# Altium project MantraDisplay.PrjPcb
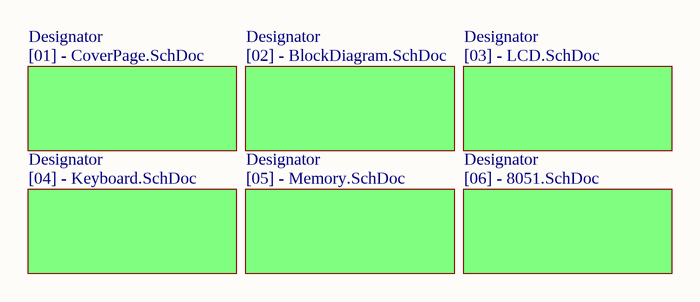
[diagram p0: DisplayBoard.SchDoc]
7 sheets, 33 parts. Net scope: flat (ports and power ports of the same name join across sheets).
Board file: DisplayBoard.PcbDoc
Sheets:
  DisplayBoard.SchDoc
    Designator = [01] - CoverPage.SchDoc
    Designator = [04] - Keyboard.SchDoc
    Designator = [02] - BlockDiagram.SchDoc
    Designator = [05] - Memory.SchDoc
    Designator = [03] - LCD.SchDoc
    Designator = [06] - 8051.SchDoc

## Sheet DisplayBoard.SchDoc: Mantra Display Board
size A4; Author: MikrySoft; Address1: MikrySoft@gmail.com; DocumentNumber: 1; Revision: 1; SheetNumber: 1; SheetTotal: 7

### Sub-sheets
Designator = [01] - CoverPage.SchDoc: no entries
Designator = [04] - Keyboard.SchDoc: no entries
Designator = [02] - BlockDiagram.SchDoc: no entries
Designator = [05] - Memory.SchDoc: no entries
Designator = [03] - LCD.SchDoc: no entries
Designator = [06] - 8051.SchDoc: no entries

### Notes on the sheet
- Title
- Size:
- Date:
- A4
- Number:
- Time:
- Revision:
- Sheet
- of
- Variation:
- Author:
- E-Mail:
- File:

## Sheet [01] - CoverPage.SchDoc: Mantra Display Board
size A4; Author: MikrySoft; Address1: MikrySoft@gmail.com; DocumentNumber: 2; Revision: 1; SheetNumber: 2; SheetTotal: 7

### Notes on the sheet
- Title
- Size:
- Date:
- A4
- Number:
- Time:
- Revision:
- Sheet
- of
- Variation:
- Author:
- E-Mail:
- File:

## Sheet [04] - Keyboard.SchDoc: Mantra Display Board
size A4; Author: MikrySoft; Address1: MikrySoft@gmail.com; DocumentNumber: 5; Revision: 1; SheetNumber: 5; SheetTotal: 7
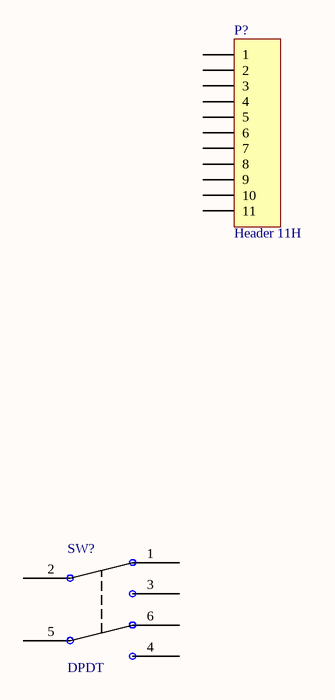
[diagram p1: [04] - Keyboard.SchDoc]

### Parts
(Parts that share a designator on the sheet are numbered #1, #2 ... from top to bottom, then left to right.)
P?#1  Header 11H  [HDR1X11H]
SW?  DPDT  [SW-EG2215]

### Nets

Not connected (* = marked no-connect by the designer): P?#1 1 2 3 4 5 6 7 8 9 10 11; SW? 1(NC-1) 2(CC-1) 3(NO-1) 4(NO-2) 5(CC-2) 6(NC-2)

### Notes on the sheet
- Title
- Size:
- Date:
- A4
- Number:
- Time:
- Revision:
- Sheet
- of
- Variation:
- Author:
- E-Mail:
- File:

### Library data of the parts
P?#1 = Header 11H: Header, 11-Pin, Right Angle; LatestRevisionDate: 17-Jul-2002; LatestRevisionNote: Re-released for DXP Platform.; Publisher: Altium Limited
SW? = SW-DPDT

## Sheet [02] - BlockDiagram.SchDoc: Mantra Display Board
size A4; Author: MikrySoft; Address1: MikrySoft@gmail.com; DocumentNumber: 3; Revision: 1; SheetNumber: 3; SheetTotal: 7

### Notes on the sheet
- Title
- Size:
- Date:
- A4
- Number:
- Time:
- Revision:
- Sheet
- of
- Variation:
- Author:
- E-Mail:
- File:

## Sheet [05] - Memory.SchDoc: Mantra Display Board
size A4; Author: MikrySoft; Address1: MikrySoft@gmail.com; DocumentNumber: 6; Revision: 1; SheetNumber: 6; SheetTotal: 7
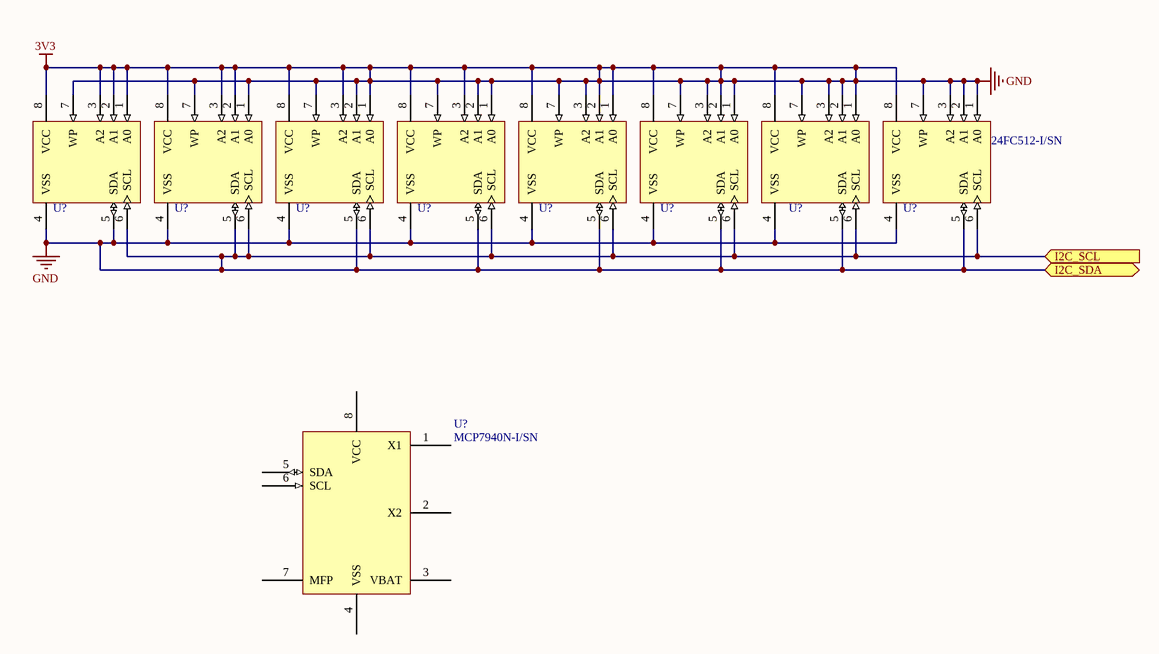
[diagram p2: [05] - Memory.SchDoc]

### Parts
(Parts that share a designator on the sheet are numbered #1, #2 ... from top to bottom, then left to right.)
U?#1  24FC512-I/SN  [MCHP-SOIC-SN8_N]  (value not drawn)
U?#2  24FC512-I/SN  [MCHP-SOIC-SN8_N]  (value not drawn)
U?#3  24FC512-I/SN  [MCHP-SOIC-SN8_N]  (value not drawn)
U?#4  24FC512-I/SN  [MCHP-SOIC-SN8_N]  (value not drawn)
U?#5  24FC512-I/SN  [MCHP-SOIC-SN8_N]  (value not drawn)
U?#6  24FC512-I/SN  [MCHP-SOIC-SN8_N]  (value not drawn)
U?#7  24FC512-I/SN  [MCHP-SOIC-SN8_N]  (value not drawn)
U?#8  24FC512-I/SN  [MCHP-SOIC-SN8_N]
U?#9  MCP7940N-I/SN  [MCP7940N-SOIC127P600X175-8N]

### Ports
I2C_SCL (in), I2C_SDA (bidir)

### Nets
3V3: U?#1.1(A0) U?#1.2(A1) U?#1.3(A2) U?#1.4(VSS) U?#1.5(SDA) U?#1.6(SCL) U?#1.7(WP) U?#1.8(VCC) U?#2.1(A0) U?#2.2(A1) U?#2.3(A2) U?#2.4(VSS) U?#2.5(SDA) U?#2.6(SCL) U?#2.7(WP) U?#2.8(VCC) U?#3.1(A0) U?#3.2(A1) U?#3.3(A2) U?#3.4(VSS) U?#3.5(SDA) U?#3.6(SCL) U?#3.7(WP) U?#3.8(VCC) U?#4.1(A0) U?#4.2(A1) U?#4.3(A2) U?#4.4(VSS) U?#4.5(SDA) U?#4.6(SCL) U?#4.7(WP) U?#4.8(VCC) U?#5.1(A0) U?#5.2(A1) U?#5.3(A2) U?#5.4(VSS) U?#5.5(SDA) U?#5.6(SCL) U?#5.7(WP) U?#5.8(VCC) U?#6.1(A0) U?#6.2(A1) U?#6.3(A2) U?#6.4(VSS) U?#6.5(SDA) U?#6.6(SCL) U?#6.7(WP) U?#6.8(VCC) U?#7.1(A0) U?#7.2(A1) U?#7.3(A2) U?#7.4(VSS) U?#7.5(SDA) U?#7.6(SCL) U?#7.7(WP) U?#7.8(VCC) U?#8.1(A0) U?#8.2(A1) U?#8.3(A2) U?#8.4(VSS) U?#8.5(SDA) U?#8.6(SCL) U?#8.7(WP) U?#8.8(VCC) ; port I2C_SCL, port I2C_SDA  [also labelled GND]  [project net SCL]

Not connected (* = marked no-connect by the designer): U?#9 1(X1) 2(X2) 3(VBAT) 4(VSS) 5(SDA) 6(SCL) 7(MFP) 8(VCC)

### Notes on the sheet
- Title
- Size:
- Date:
- A4
- Number:
- Time:
- Revision:
- Sheet
- of
- Variation:
- Author:
- E-Mail:
- File:

### Library data of the parts
U?#1-U?#8 = 24FC512-I/SN: 512K bits I2C™ Serial EEPROM, 1.7 to 5.5 V, 1 MHz, -40 to 85 degC, 8-pin SOIC (SN8), Tube; Manufacturer: Microchip; DatasheetVersion: Rev. M; PackageVersion: C04-057C; PackageReference: SOIC-SN8; PackageDescription: 8-Lead Plastic Small Outline, 4.9 x 3.9 mm Body, 1.27 mm Pitch; Supplier 1: Digi-Key; Supplier Part Number 1: 24FC512-I/SN-ND; Supplier 2: Newark; Supplier Part Number 2: 08R2176; Supplier 3: Mouser; Supplier Part Number 3: 579-24FC512-I/SN; Mounting Technology: Surface Mount; PartNumber: 24FC512-I/SN; ComponentLink1Description: Manufacturer URL; ComponentLink1URL: http://www.microchip.com; ComponentLink2Description: Datasheet; ComponentLink2URL: http://ww1.microchip.com/downloads/en/DeviceDoc/21754M.pdf; ComponentLink3Description: Package Specification; ComponentLink3URL: http://www.microchip.com/stellent/groups/techpub_sg/documents/packagingspec/en012702.pdf; ComponentLink4Description: Product URL; ComponentLink4URL: http://www.microchip.com/24FC512
U?#9 = MCP7940N-I/SN: I2C RTCC with SRAM

## Sheet [03] - LCD.SchDoc: Mantra Display Board
size A4; Author: MikrySoft; Address1: MikrySoft@gmail.com; DocumentNumber: 4; Revision: 1; SheetNumber: 4; SheetTotal: 7
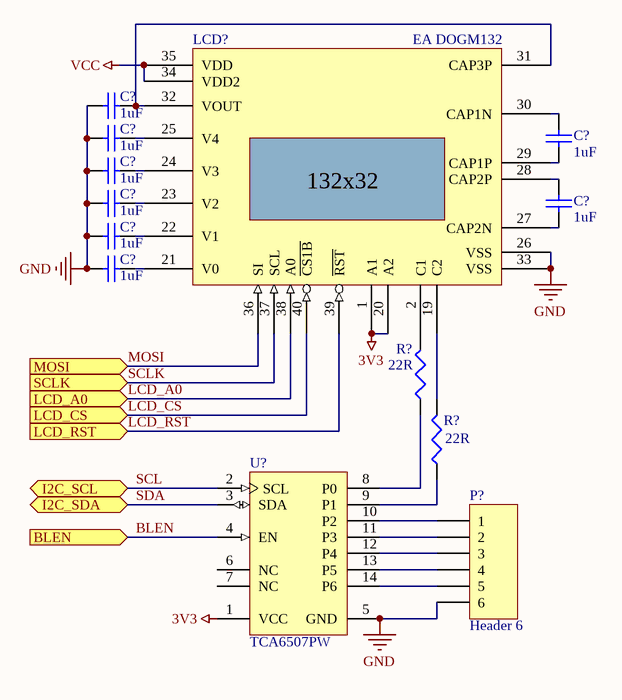
[diagram p3: [03] - LCD.SchDoc]

### Parts
(Parts that share a designator on the sheet are numbered #1, #2 ... from top to bottom, then left to right.)
C?#1  value 1uF  [1608[0603]]  (hidden comment: Cap Semi)
C?#2  value 1uF  [1608[0603]]  (hidden comment: Cap Semi)
C?#3  value 1uF  [1608[0603]]  (hidden comment: Cap Semi)
C?#4  value 1uF  [1608[0603]]  (hidden comment: Cap Semi)
C?#5  value 1uF  [1608[0603]]  (hidden comment: Cap Semi)
C?#6  value 1uF  [1608[0603]]  (hidden comment: Cap Semi)
C?#7  value 1uF  [1608[0603]]  (hidden comment: Cap Semi)
C?#8  value 1uF  [1608[0603]]  (hidden comment: Cap Semi)
LCD?  EA DOGM132  [EA DOGM132-5]
P?#2  Header 6  [HDR1X6]
R?#1  value 22R  [J1-0603]  (hidden comment: Res3)
R?#2  value 22R  [J1-0603]  (hidden comment: Res3)
U?#10  TCA6507PW  [PW14_M]

### Ports
BLEN (in), I2C_SCL (bidir), I2C_SDA (bidir), LCD_A0 (in), LCD_CS (in), LCD_RST (in), MOSI (in), SCLK (in)

### Nets
SCL: C?#1.1 C?#2.1 C?#4.1 C?#5.1 C?#7.1 C?#8.1 LCD?.1(A1) LCD?.20(A2) LCD?.26(VSS) LCD?.33(VSS) P?#2.6 U?#10.1(VCC) U?#10.2(SCL) U?#10.3(SDA) U?#10.5(GND) ; port I2C_SDA, port I2C_SCL  [also labelled 3V3, GND, SDA]
VCC: LCD?.34(VDD2) LCD?.35(VDD)
BLEN: U?#10.4(EN) ; port BLEN
LCD_A0: LCD?.38(A0) ; port LCD_A0
LCD_CS: LCD?.40(~{CS1B}) ; port LCD_CS
LCD_RST: LCD?.39(~{RST}) ; port LCD_RST
MOSI: LCD?.36(SI) ; port MOSI
SCLK: LCD?.37(SCL) ; port SCLK
NetC?#1_2: C?#1.2 LCD?.31(CAP3P) LCD?.32(VOUT)
NetC?#2_2: C?#2.2 LCD?.25(V4)
NetC?#3_1: C?#3.1 LCD?.30(CAP1N)
NetC?#3_2: C?#3.2 LCD?.29(CAP1P)
NetC?#4_2: C?#4.2 LCD?.24(V3)
NetC?#5_2: C?#5.2 LCD?.23(V2)
NetC?#6_1: C?#6.1 LCD?.28(CAP2P)
NetC?#6_2: C?#6.2 LCD?.27(CAP2N)
NetC?#7_2: C?#7.2 LCD?.22(V1)
NetC?#8_2: C?#8.2 LCD?.21(V0)
NetLCD?_2: LCD?.2(C1) R?#1.2
NetLCD?_19: LCD?.19(C2) R?#2.2
NetP?#2_1: P?#2.1 U?#10.10(P2)
NetP?#2_2: P?#2.2 U?#10.11(P3)
NetP?#2_3: P?#2.3 U?#10.12(P4)
NetP?#2_4: P?#2.4 U?#10.13(P5)
NetP?#2_5: P?#2.5 U?#10.14(P6)
NetR?#1_1: R?#1.1 U?#10.8(P0)
NetR?#2_1: R?#2.1 U?#10.9(P1)

Not connected (* = marked no-connect by the designer): U?#10 6(NC) 7(NC)

### Notes on the sheet
- Title
- Size:
- Date:
- A4
- Number:
- Time:
- Revision:
- Sheet
- of
- Variation:
- Author:
- E-Mail:
- File:
- (in symbol EA DOGM132) 132x32

### Library data of the parts
C?#1-C?#8 = Cap Semi: Capacitor (Semiconductor SIM Model); Published: 8-Jun-2000; LatestRevisionDate: 29-May-2009; LatestRevisionNote: IPC-7351 Footprint Added.; PackageReference: C1206; Publisher: Altium Limited; PackageDescription: Chip Capacitor
LCD? = EA DOGM132: 132x32 graphical LCD
P?#2 = Header 6: Header, 6-Pin; LatestRevisionDate: 17-Jul-2002; LatestRevisionNote: Re-released for DXP Platform.; Publisher: Altium Limited
R?#1 R?#2 = Res3: Resistor; Published: 8-Jun-2000; LatestRevisionDate: 29-May-2009; LatestRevisionNote: IPC-7351 Footprint Added.; PackageReference: J1-0603; Publisher: Altium Limited; PackageDescription: Chip Resistor
U?#10 = TCA6507PW: Low-Voltage 7-Bit I2C and SMBus LED Driver with Intensity Control and Shutdown, 1.65 to 3.6 V, -40 to 85 degC, 14-pin TSSOP (PW), Green (RoHS & no Sb/Br); Manufacturer: Texas Instruments; SubFamily: I2C Special Function; fSCLK(Max)(MHz): 400; VCC(Min)(V): 1.65; VCC(Max)(V): 3.6; I2C Address: 1000101; Enable Pin: Yes; Rating: Catalog; DatasheetVersion: SCPS164B; PackageVersion: revG, Feb-2011; PackageReference: PW14; PackageDescription: 14-Pin Thin Small Outline Package 0.65 mm Pitch; Supplier 1: Digi-Key; Supplier Part Number 1: TCA6507PW-ND; Supplier 2: Farnell; Supplier Part Number 2: 1647813; Supplier 3: Newark; Supplier Part Number 3: 54M7301; Supplier 4: Mouser; Supplier Part Number 4: 595-TCA6507PW; Eco-Plan: Green (RoHS & no Sb/Br); Max Frequency(kHz): 400; Function: LED Driver; Vcc range(V): 1.65 to 3.6; Open Drain I/O Type: Yes; 5V Tolerant I/O: Yes; On-Chip Power-on-Reset: Yes; Mounting Technology: Surface Mount; PartNumber: TCA6507PW; Code_JEDEC: MO-153; ComponentLink1Description: Datasheet; ComponentLink1URL: http://www.ti.com/general/docs/lit/getliterature.tsp?genericPartNumber=TCA6507&fileType=pdf; ComponentLink2Description: Package Specification; ComponentLink2URL: http://www.ti.com/litv/pdf/mpds177g

## Sheet [06] - 8051.SchDoc: Mantra Display Board
size A4; Author: MikrySoft; Address1: MikrySoft@gmail.com; DocumentNumber: 7; Revision: 1; SheetNumber: 7; SheetTotal: 7
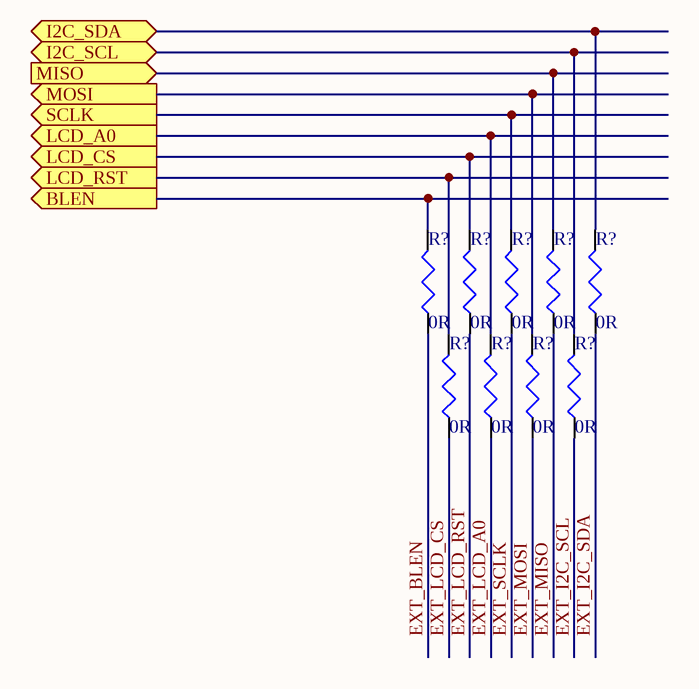
[diagram p4: [06] - 8051.SchDoc]

### Parts
(Parts that share a designator on the sheet are numbered #1, #2 ... from top to bottom, then left to right.)
R?#3  value 0R  [J1-0603]  (hidden comment: Res3)
R?#4  value 0R  [J1-0603]  (hidden comment: Res3)
R?#5  value 0R  [J1-0603]  (hidden comment: Res3)
R?#6  value 0R  [J1-0603]  (hidden comment: Res3)
R?#7  value 0R  [J1-0603]  (hidden comment: Res3)
R?#8  value 0R  [J1-0603]  (hidden comment: Res3)
R?#9  value 0R  [J1-0603]  (hidden comment: Res3)
R?#10  value 0R  [J1-0603]  (hidden comment: Res3)
R?#11  value 0R  [J1-0603]  (hidden comment: Res3)

### Ports
BLEN (out), I2C_SCL (bidir), I2C_SDA (bidir), LCD_A0 (out), LCD_CS (out), LCD_RST (out), MISO (in), MOSI (out), SCLK (out)

### Nets
SCL: R?#7.2 R?#11.2 ; port I2C_SDA, port I2C_SCL
BLEN: R?#3.2 ; port BLEN
EXT_BLEN: R?#3.1
EXT_I2C_SCL: R?#11.1
EXT_I2C_SDA: R?#7.1
EXT_LCD_A0: R?#9.1
EXT_LCD_CS: R?#8.1
EXT_LCD_RST: R?#4.1
EXT_MISO: R?#6.1
EXT_MOSI: R?#10.1
EXT_SCLK: R?#5.1
LCD_A0: R?#9.2 ; port LCD_A0
LCD_CS: R?#4.2 ; port LCD_CS
LCD_RST: R?#8.2 ; port LCD_RST
MOSI: R?#10.2 ; port MOSI
SCLK: R?#5.2 ; port SCLK
NetR?#6_2: R?#6.2 ; port MISO

### Notes on the sheet
- Title
- Size:
- Date:
- A4
- Number:
- Time:
- Revision:
- Sheet
- of
- Variation:
- Author:
- E-Mail:
- File:

### Library data of the parts
R?#3-R?#11 = Res3: Resistor; Published: 8-Jun-2000; LatestRevisionDate: 29-May-2009; LatestRevisionNote: IPC-7351 Footprint Added.; PackageReference: J1-0603; Publisher: Altium Limited; PackageDescription: Chip Resistor

## Nets that join several sheets
SCL: [05] - Memory (64 pins), [03] - LCD (15 pins), [06] - 8051 (R?#7.2 R?#11.2)
BLEN: [03] - LCD (U?#10.4), [06] - 8051 (R?#3.2)
LCD_A0: [03] - LCD (LCD?.38), [06] - 8051 (R?#9.2)
LCD_CS: [03] - LCD (LCD?.40), [06] - 8051 (R?#4.2)
LCD_RST: [03] - LCD (LCD?.39), [06] - 8051 (R?#8.2)
MOSI: [03] - LCD (LCD?.36), [06] - 8051 (R?#10.2)
SCLK: [03] - LCD (LCD?.37), [06] - 8051 (R?#5.2)